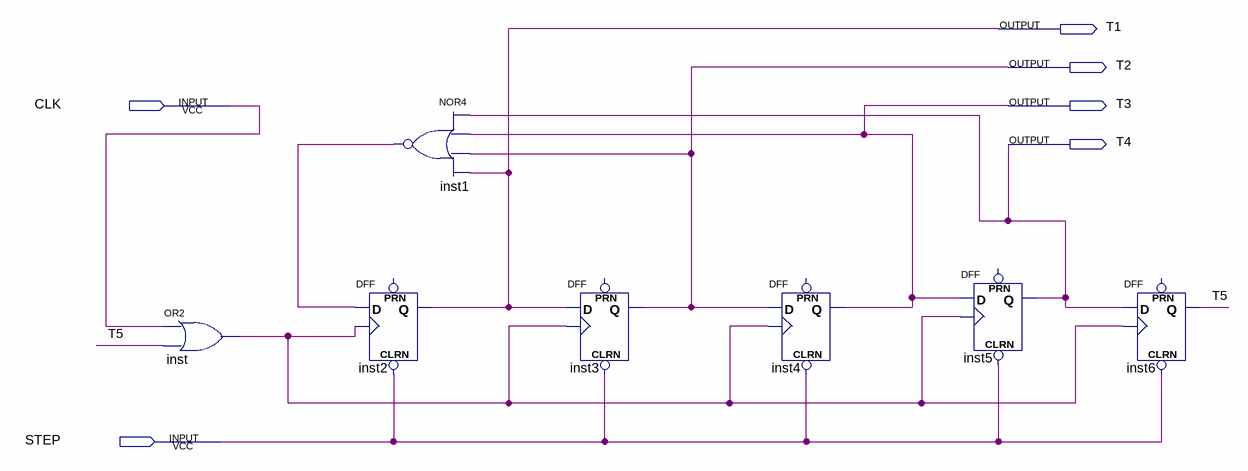
[diagram p0: schematic sheet]
// Quartus schematic step.bdf as structural Verilog: 7 symbols, 6 pins
module step (
  input  CLK,
  input  STEP,
  output T1,
  output T2,
  output T3,
  output T4
);

  wire inst1_out, inst_out, T5;

  or inst (inst_out, CLK, T5);
  nor inst1 (inst1_out, T4, T3, T2, T1);
  DFF inst2 (.CLRN(STEP), .CLK(inst_out), .D(inst1_out), .Q(T1));  // open: PRN
  DFF inst3 (.CLRN(STEP), .CLK(inst_out), .D(T1), .Q(T2));  // open: PRN
  DFF inst4 (.CLRN(STEP), .CLK(inst_out), .D(T2), .Q(T3));  // open: PRN
  DFF inst5 (.CLRN(STEP), .CLK(inst_out), .D(T3), .Q(T4));  // open: PRN
  DFF inst6 (.CLRN(STEP), .CLK(inst_out), .D(T4), .Q(T5));  // open: PRN
endmodule
